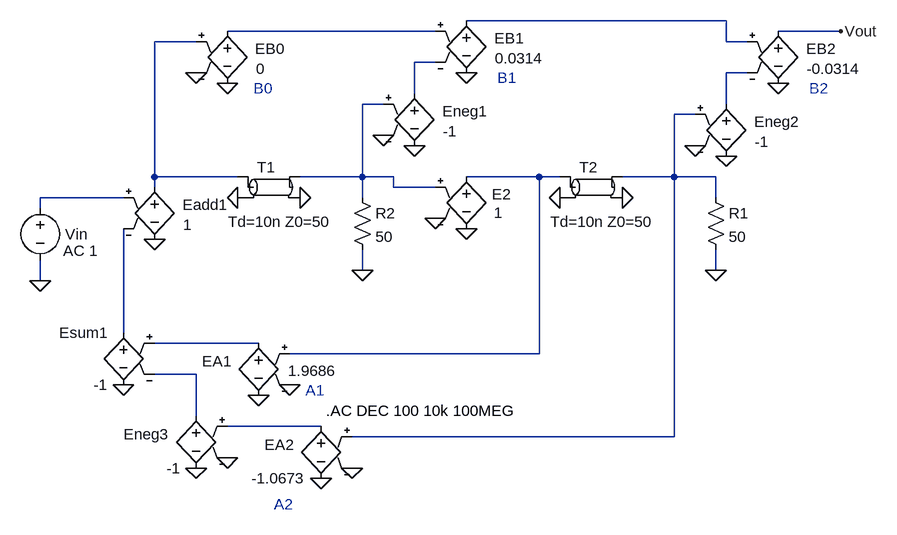
[diagram p0: schematic _Sim_Biquad_Template.asc]
_Sim_Biquad_Template.asc, the LTspice schematic file:
Version 4
SHEET 1 2740 696
WIRE 1568 -976 1168 -976
WIRE 1120 -960 800 -960
WIRE 1744 -960 1648 -960
WIRE 752 -944 688 -944
WIRE 1568 -944 1568 -976
WIRE 1600 -944 1568 -944
WIRE 1120 -912 1088 -912
WIRE 1600 -896 1568 -896
WIRE 1088 -864 1088 -912
WIRE 1040 -848 1008 -848
WIRE 1568 -848 1568 -896
WIRE 1520 -832 1488 -832
WIRE 688 -736 688 -944
WIRE 816 -736 688 -736
WIRE 1008 -736 1008 -848
WIRE 1008 -736 912 -736
WIRE 1056 -736 1008 -736
WIRE 1280 -736 1168 -736
WIRE 1312 -736 1280 -736
WIRE 1488 -736 1488 -832
WIRE 1488 -736 1408 -736
WIRE 1552 -736 1488 -736
WIRE 688 -720 688 -736
WIRE 1056 -720 1056 -736
WIRE 1120 -720 1056 -720
WIRE 640 -704 512 -704
WIRE 1008 -704 1008 -736
WIRE 1552 -704 1552 -736
WIRE 512 -688 512 -704
WIRE 1008 -592 1008 -624
WIRE 1552 -592 1552 -624
WIRE 512 -576 512 -608
WIRE 640 -496 640 -656
WIRE 848 -480 688 -480
WIRE 1280 -464 1280 -736
WIRE 1280 -464 896 -464
WIRE 752 -432 688 -432
WIRE 752 -368 752 -432
WIRE 944 -352 800 -352
WIRE 1488 -336 1488 -736
WIRE 1488 -336 992 -336
FLAG 912 -704 0
FLAG 816 -704 0
FLAG 688 -640 0
FLAG 512 -576 0
FLAG 1744 -960 Vout
FLAG 1552 -592 0
FLAG 1408 -704 0
FLAG 1312 -704 0
FLAG 640 -416 0
FLAG 848 -400 0
FLAG 896 -416 0
FLAG 944 -272 0
FLAG 992 -288 0
FLAG 1008 -592 0
FLAG 1168 -656 0
FLAG 1120 -672 0
FLAG 752 -896 0
FLAG 800 -880 0
FLAG 1040 -800 0
FLAG 1088 -784 0
FLAG 1168 -896 0
FLAG 1520 -784 0
FLAG 1568 -768 0
FLAG 1648 -880 0
FLAG 800 -304 0
FLAG 752 -288 0
SYMBOL tline 864 -720 R0
WINDOW 0 -18 -31 Left 0
WINDOW 3 -63 53 Left 0
SYMATTR InstName T1
SYMATTR Value Td=10n Z0=50
SYMBOL e 688 -736 R0
WINDOW 0 43 43 Left 0
WINDOW 3 44 74 Left 0
SYMATTR InstName Eadd1
SYMATTR Value 1
SYMBOL voltage 512 -704 R0
WINDOW 0 38 56 Left 0
WINDOW 123 35 82 Left 0
WINDOW 39 0 0 Left 0
SYMATTR InstName Vin
SYMATTR Value2 AC 1
SYMATTR Value ""
SYMBOL res 1536 -720 R0
SYMATTR InstName R1
SYMATTR Value 50
SYMBOL tline 1360 -720 R0
WINDOW 0 -18 -31 Left 0
WINDOW 3 -63 53 Left 0
SYMATTR InstName T2
SYMATTR Value Td=10n Z0=50
SYMBOL e 640 -512 M0
SYMATTR InstName Esum1
SYMATTR Value -1
SYMBOL e 848 -496 M0
WINDOW 0 42 44 Left 0
WINDOW 3 -120 58 Left 0
SYMATTR InstName EA1
SYMATTR Value 1.9686
SYMBOL e 944 -368 M0
WINDOW 0 42 44 Left 0
SYMATTR InstName EA2
SYMATTR Value -1.0673
SYMBOL res 992 -720 R0
SYMATTR InstName R2
SYMATTR Value 50
SYMBOL e 1168 -752 R0
WINDOW 0 39 43 Left 0
WINDOW 3 42 71 Left 0
SYMATTR InstName E2
SYMATTR Value 1
SYMBOL e 800 -976 R0
WINDOW 0 43 43 Left 0
WINDOW 3 44 74 Left 0
SYMATTR InstName EB0
SYMATTR Value 0
SYMBOL e 1088 -880 R0
WINDOW 0 43 43 Left 0
WINDOW 3 44 74 Left 0
SYMATTR InstName Eneg1
SYMATTR Value -1
SYMBOL e 1168 -992 R0
WINDOW 0 43 43 Left 0
WINDOW 3 44 74 Left 0
SYMATTR InstName EB1
SYMATTR Value 0.0314
SYMBOL e 1568 -864 R0
WINDOW 0 43 43 Left 0
WINDOW 3 44 74 Left 0
SYMATTR InstName Eneg2
SYMATTR Value -1
SYMBOL e 1648 -976 R0
WINDOW 0 43 43 Left 0
WINDOW 3 44 74 Left 0
SYMATTR InstName EB2
SYMATTR Value -0.0314
SYMBOL e 752 -384 M0
WINDOW 0 42 44 Left 0
SYMATTR InstName Eneg3
SYMATTR Value -1
TEXT 952 -376 Left 0 !.AC DEC 100 10k 100MEG
TEXT 840 -872 Left 0 ;B0
TEXT 1216 -888 Left 0 ;B1
TEXT 1696 -872 Left 0 ;B2
TEXT 920 -408 Left 0 ;A1
TEXT 872 -232 Left 0 ;A2

The netlist it stands for:
* _Sim_Biquad_Template.asc
T1 N003 0 N006 0 Td=10n Z0=50
Eadd1 N003 0 N009 N010 1
Vin N009 0 AC 1
R1 N007 0 50
T2 N008 0 N007 0 Td=10n Z0=50
Esum1 N010 0 N011 N012 -1
EA1 N011 0 N008 0 1.9686
EA2 N013 0 N007 0 -1.0673
R2 N006 0 50
E2 N008 0 N006 0 1
EB0 N002 0 N003 0 0
Eneg1 N004 0 N006 0 -1
EB1 N001 0 N002 N004 0.0314
Eneg2 N005 0 N007 0 -1
EB2 Vout 0 N001 N005 -0.0314
Eneg3 N012 0 N013 0 -1
.AC DEC 100 10k 100MEG
* B0
* B1
* B2
* A1
* A2
.backanno
.end